# Altium schematic sheet PLWD_GNSS_1.SchDoc
size A3; SheetNumber: 5; SheetTotal: 11
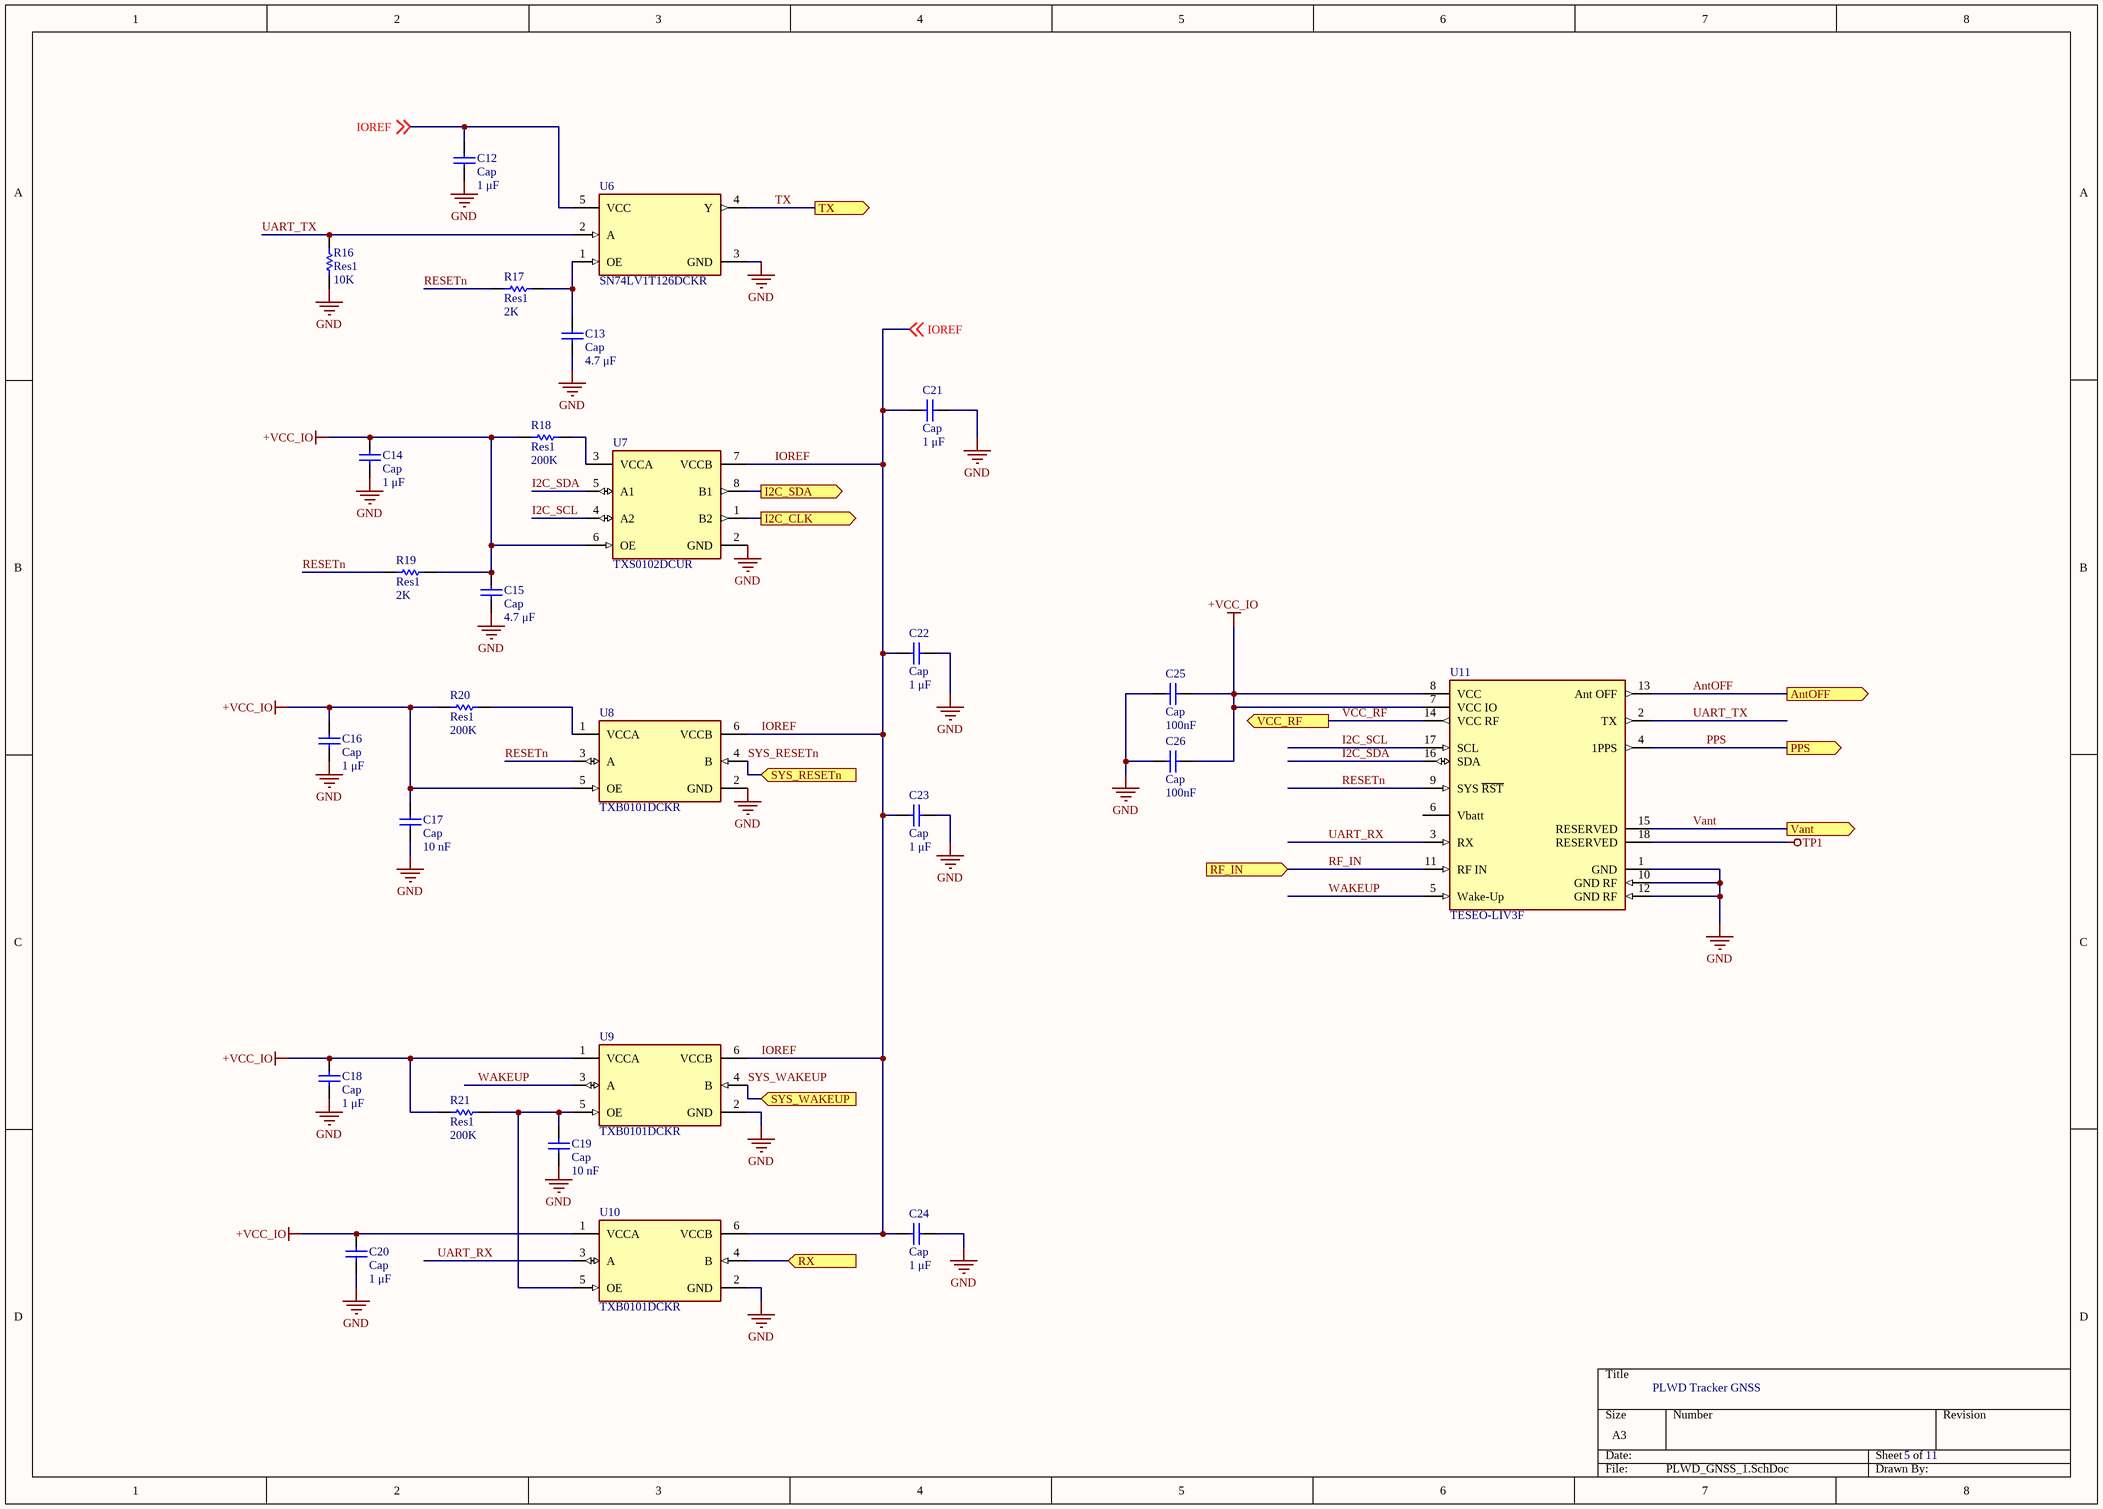
[diagram p0: PLWD_GNSS_1.SchDoc]

## Parts
C12  Cap  value 1 μF  [RAD-0.3]
C13  Cap  value 4.7 μF  [RAD-0.3]
C14  Cap  value 1 μF  [RAD-0.3]
C15  Cap  value 4.7 μF  [RAD-0.3]
C16  Cap  value 1 μF  [RAD-0.3]
C17  Cap  value 10 nF  [RAD-0.3]
C18  Cap  value 1 μF  [RAD-0.3]
C19  Cap  value 10 nF  [RAD-0.3]
C20  Cap  value 1 μF  [RAD-0.3]
C21  Cap  value 1 μF  [RAD-0.3]
C22  Cap  value 1 μF  [RAD-0.3]
C23  Cap  value 1 μF  [RAD-0.3]
C24  Cap  value 1 μF  [RAD-0.3]
C25  Cap  value 100nF  [RAD-0.3]
C26  Cap  value 100nF  [RAD-0.3]
R16  Res1  value 10K  [AXIAL-0.3]
R17  Res1  value 2K  [AXIAL-0.3]
R18  Res1  value 200K  [AXIAL-0.3]
R19  Res1  value 2K  [AXIAL-0.3]
R20  Res1  value 200K  [AXIAL-0.3]
R21  Res1  value 200K  [AXIAL-0.3]
U6  SN74LV1T126DCKR  [FP-DCK0005A-IPC_A]
U7  TXS0102DCUR  [FP-DCU0008A-MFG]
U8  TXB0101DCKR  [FP-DCK0006A-MFG]
U9  TXB0101DCKR  [FP-DCK0006A-MFG]
U10  TXB0101DCKR  [FP-DCK0006A-MFG]
U11  TESEO-LIV3F  [FP-LCC-18-MFG]

## Ports
AntOFF (out), I2C_CLK (out), I2C_SDA (out), PPS (out), RF_IN (in), RX (in), SYS_RESETn (in), SYS_WAKEUP (in), TX (out), Vant (out), VCC_RF (out)

## Nets
+VCC_IO: C14.2 C15.2 C16.2 C17.2 C18.2 C20.2 C25.2 C26.2 R18.1 R19.2 R20.1 R21.1 U7.6(OE) U8.5(OE) U9.1(VCCA) U10.1(VCCA) U11.7(VCC_IO) U11.8(VCC)
GND: C12.1 C13.1 C14.1 C15.1 C16.1 C17.1 C18.1 C19.1 C20.1 C21.2 C22.2 C23.2 C24.2 C25.1 C26.1 R16.1 U6.3(GND) U7.2(GND) U8.2(GND) U9.2(GND) U10.2(GND) U11.1(GND) U11.10(GND_RF) U11.12(GND_RF)
TP1: U11.18(RESERVED)
AntOFF: U11.13(Ant_OFF) ; port AntOFF
I2C_CLK: U7.1(B2) ; port I2C_CLK
I2C_SCL: U7.4(A2) U11.17(SCL)
I2C_SDA: U7.5(A1) U11.16(SDA)
I2C_SDA: U7.8(B1) ; port I2C_SDA  [a separate net that carries the same name]
IOREF: C12.2 C21.1 C22.1 C23.1 C24.1 U6.5(VCC) U7.7(VCCB) U8.6(VCCB) U9.6(VCCB) U10.6(VCCB) ; off-sheet IOREF
PPS: U11.4(1PPS) ; port PPS
RESETn: R17.1 R19.1 U8.3(A) U11.9(SYS_~{RST})
RF_IN: U11.11(RF_IN) ; port RF_IN
RX: U10.4(B) ; port RX
SYS_RESETn: U8.4(B) ; port SYS_RESETn
SYS_WAKEUP: U9.4(B) ; port SYS_WAKEUP
TX: U6.4(Y) ; port TX
UART_RX: U10.3(A) U11.3(RX)
UART_TX: R16.2 U6.2(A) U11.2(TX)
Vant: U11.15(RESERVED) ; port Vant
VCC_RF: U11.14(VCC_RF) ; port VCC_RF
WAKEUP: U9.3(A) U11.5(Wake-Up)
NetC13_2: C13.2 R17.2 U6.1(OE)
NetC19_2: C19.2 R21.2 U9.5(OE) U10.5(OE)
NetR18_2: R18.2 U7.3(VCCA)
NetR20_2: R20.2 U8.1(VCCA)

Not connected (* = marked no-connect by the designer): U11 6(Vbatt)

## Notes on the sheet
- PLWD Tracker GNSS
- 5
- 11

## Library data of the parts
C12-C26 = Cap: Capacitor; Published: 8-Jun-2000; LatestRevisionDate: 17-Jul-2002; LatestRevisionNote: Re-released for DXP Platform.; PackageReference: RAD-0.3; Publisher: Altium Limited; PackageDescription: Radial Cap, Thru-Hole; 2 Leads; 0.3 in Pin Spacing
R16-R21 = Res1: Resistor; Published: 8-Jun-2000; LatestRevisionDate: 17-Jul-2002; LatestRevisionNote: Re-released for DXP Platform.; PackageReference: AXIAL-0.3; Publisher: Altium Limited; PackageDescription: Axial Device, Thru-Hole; 2 Leads; 0.3 in Pin Spacing
U6 = CMP-0859-00355-4: IC BUF NON-INVERT 5.5V SC70-5; Number of Inputs: 1; Operating Supply Current: 8mA; Propagation Delay: 16ns; High Level Output Current: -8mA; Quiescent Current: 1uA; Logic Function: Buffer; Min Supply Voltage: 1.6V; Polarity: Non-Inverting; Number of Pins: 5; Package Quantity: 3000; REACH SVHC: No SVHC; Case/Package: SC; Radiation Hardening: No; Lead Free: Lead Free; Number of Elements: 1; Number of Input Lines: 1; Number of Bits: 1; Max Operating Temperature: 125°C; Mount: Surface Mount; Number of Bits per Element: 1; Low Level Output Current: 8mA; RoHS Compliant: Yes; Number of Output Lines: 1; Weight: 0.000215oz; Number of Outputs: 1; Number of Channels: 1; Min Operating Temperature: -40°C; Contact Plating: Gold; Packaging: Tape and Reel; Max Supply Voltage: 5.5V
U7 = CMP-0859-00001-2: IC TRNSLTR BIDIRECTIONAL US8; Manufacturer: Texas Instruments; Number Of Circuits: 1; Number Of Inputs: 2; Data Rate: 24Mbits/s; Max Junction Temp: +150°C; V A Min: 1.65V; Standoff Height: 0mm; Logic Function Desc: Bidirectional Voltage-Level Translator; Max Supply Voltage: 5.5V; V A Max: 3.6V; Nominal Supply Current: 1-14.4uA; V B Min: 2.3V; Temperature: -40°C to +85°C; Temperature Range Low: -40°C; Height: 0.9mm; Device Class L1: Integrated Circuits (ICs); RoHS: TRUE; Min Supply Voltage: 1.65V; Digikey Description: IC TRNSLTR BIDIRECTIONAL US8; ComponentLink2Description: Datasheet; Octopart: https://octopart.com/txs0102dcur-texas+instruments-5414308; Temperature Range High: +85°C; Device Class L2: Logic ICs; Category: IC; Ambient Temperature Range High: +85°C; Automotive: No; Manufacturer Part Number: TXS0102DCUR; Device Class L3: Voltage Level Shifters; Number Of Outputs: 2; Ambient Temperature Range Low: -40°C; Lead Free: Yes; ComponentLink2URL: http://www.ti.com/lit/ds/symlink/txs0102.pdf; V B Max: 5.5V; Package: DCU0008A; Mouser Description: Translation - Voltage Levels 2-Bit Bi-Directional Voltage-Level-Trans
U8-U10 = CMP-04899-000110-1: IC TRNSLTR BIDIRECTIONAL SC70-6; Number of Bits: 1; Low Level Output Current: 20uA; Data Rate: 100Mbps; Logic Function: Translator; Min Supply Voltage: 1.2V; Turn-On Delay Time: 7.4ns; Propagation Delay: 31ns; High Level Output Current: -20uA; Max Supply Voltage: 5.5V; Series: -; Height: 1mm; Packaging: Tape and Reel; RoHS Compliant: Yes; Width: 1.4mm; Package Quantity: 1; Mount: Surface Mount; Case/Package: SC; Length: 2.15mm; Number of Pins: 6; Max Operating Temperature: 85°C; Contact Plating: Gold; Min Operating Temperature: -40°C; Radiation Hardening: No; Lead Free: Lead Free; Number of Inputs: 1; Number of Channels: 1; REACH SVHC: No SVHC
U11 = CMP-12160-000003-1: RF RCVR GNSS/GPS 1.575GHZ 18LCC; Manufacturer: STMicroelectronics; Min Supply Voltage: 2.1V; Max Supply Voltage: 4.3V; Interface: I2C,UART; Sensitivity: -163dBm; Max Frequency: 1575.42MHz; ComponentLink2Description: Datasheet; Package: LCC-18; RoHS: TRUE; Temperature Range Low: -40°C; Manufacturer Part Number: TESEO-LIV3F; Ambient Temperature Range Low: -40°C; ComponentLink2URL: https://www.st.com/resource/en/datasheet/teseo-liv3f.pdf; Octopart: https://octopart.com/teseo-liv3f-stmicroelectronics-84762432; Device Class L1: Integrated Circuits (ICs); Mouser Description: Rf Receiver, 1.57542Ghz, -40 To 85Deg C; Digikey Description: RF RCVR GNSS/GPS 1.575GHZ 18LCC; Device Class L3: RF Receivers; Ambient Temperature Range High: +85°C; Temperature Range High: +85°C; Lead Free: Yes; Height: 2.33mm; Automotive: No; Category: UNK; Temperature: -40°C to +85°C; Device Class L2: RF Semiconductors and Devices